# Altium project Blue_Pill.PrjPcb
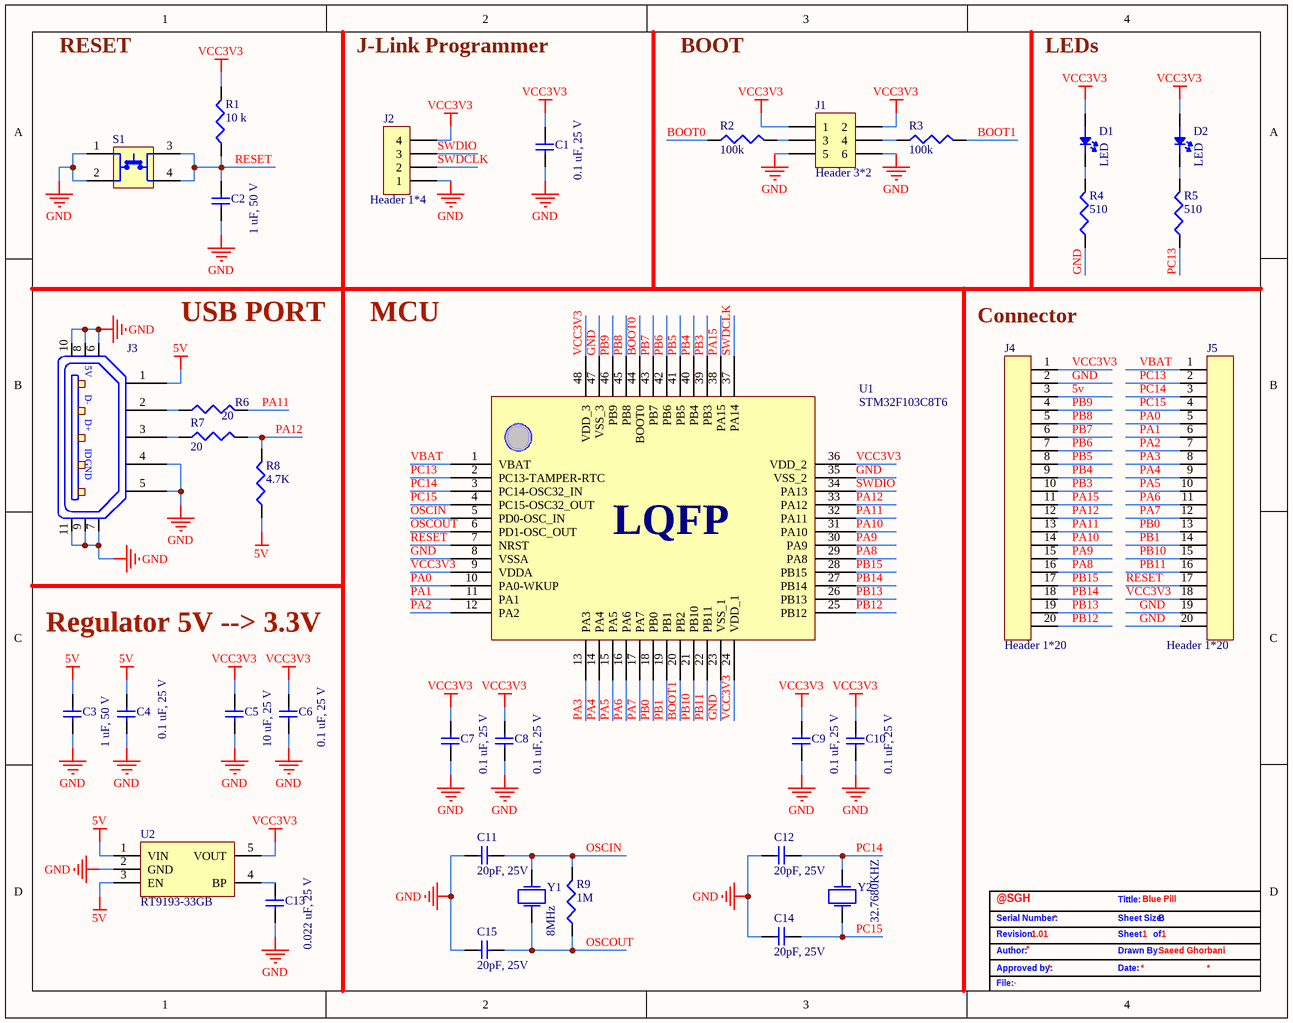
[diagram p0: Blue_Pill_Sehmatic.SchDoc]
1 sheet, 36 parts. Net scope: global (net labels, ports and power ports of the same name join across sheets).
Board file: Blue_Pill_pcb.PcbDoc

## Sheet Blue_Pill_Sehmatic.SchDoc: Blue Pill
size A; DrawnBy: Saeed Ghorbani; Revision: 1.01; SheetNumber: 1; SheetTotal: 1

### Parts
C1  0.1 uF, 25 V  [C0805]
C2  1 uF, 50 V  [C0805]
C3  1 uF, 50 V  [C0805]
C4  0.1 uF, 25 V  [C0805]
C5  10 uF, 25 V  [C0805]
C6  0.1 uF, 25 V  [C0805]
C7  0.1 uF, 25 V  [C0805]
C8  0.1 uF, 25 V  [C0805]
C9  0.1 uF, 25 V  [C0805]
C10  0.1 uF, 25 V  [C0805]
C11  20pF, 25V  [C0805]
C12  20pF, 25V  [C0805]
C13  0.022 uF, 25 V  [C0805]
C14  20pF, 25V  [C0805]
C15  20pF, 25V  [C0805]
D1  LED  [LED0603]
D2  LED  [LED0603]
J1  Header 3*2  [Header 3*2]
J2  Header 1*4  [Header 4*1]
J3  10118194-0001LF  [10118194-0001LF]  (value not drawn)
J4  Header 1*20  [header 20*1]
J5  Header 1*20  [header 20*1]
R1  10 k  [R0805]
R2  100k  [R0805]
R3  100k  [R0805]
R4  510  [R0805]
R5  510  [R0805]
R6  20  [R0805]
R7  20  [R0805]
R8  4.7K  [R0805]
R9  1M  [R0805]
S1  PTS526SM15SMTR2LFS  [PTS526SM15SMTR2LFS]  (value not drawn)
U1  STM32F103C8T6  [LQFP48]
U2  RT9193-33GB  [SOT95P280X100-5N]
Y1  8MHz  [FC4SD]
Y2  32.7680KHZ  [CM8V-T1A]

### Nets
5v: C3.2 C4.2 J3.1 J4.3 R8.1 U2.1(VIN) U2.3(EN)
GND: C1.1 C2.1 C3.1 C4.1 C5.1 C6.1 C7.1 C8.1 C9.1 C10.1 C11.1 C12.1 C13.1 C14.1 C15.1 J1.5 J1.6 J2.1 J3.4 J3.5 J3.6 J3.7 J3.8 J3.9 J3.10 J3.11 J4.2 J5.19 J5.20 R4.1 S1.1 S1.2 U1.8(VSSA) U1.23(VSS_1) U1.35(VSS_2) U1.47(VSS_3) U2.2(GND)
VCC3V3: C1.2 C5.2 C6.2 C7.2 C8.2 C9.2 C10.2 D1.1(Anode) D2.1(Anode) J1.1 J1.2 J2.4 J4.1 J5.18 R1.2 U1.9(VDDA) U1.24(VDD_1) U1.36(VDD_2) U1.48(VDD_3) U2.5(VOUT)
BOOT0: R2.1 U1.44(BOOT0)
BOOT1: R3.2 U1.20(PB2)
OSCIN: C11.2 R9.2 U1.5(PD0-OSC_IN) Y1.2
OSCOUT: C15.2 R9.1 U1.6(PD1-OSC_OUT) Y1.1
PA0: J5.5 U1.10(PA0-WKUP)
PA1: J5.6 U1.11(PA1)
PA2: J5.7 U1.12(PA2)
PA3: J5.8 U1.13(PA3)
PA4: J5.9 U1.14(PA4)
PA5: J5.10 U1.15(PA5)
PA6: J5.11 U1.16(PA6)
PA7: J5.12 U1.17(PA7)
PA8: J4.16 U1.29(PA8)
PA9: J4.15 U1.30(PA9)
PA10: J4.14 U1.31(PA10)
PA11: J4.13 R6.2 U1.32(PA11)
PA12: J4.12 R7.2 R8.2 U1.33(PA12)
PA15: J4.11 U1.38(PA15)
PB0: J5.13 U1.18(PB0)
PB1: J5.14 U1.19(PB1)
PB3: J4.10 U1.39(PB3)
PB4: J4.9 U1.40(PB4)
PB5: J4.8 U1.41(PB5)
PB6: J4.7 U1.42(PB6)
PB7: J4.6 U1.43(PB7)
PB8: J4.5 U1.45(PB8)
PB9: J4.4 U1.46(PB9)
PB10: J5.15 U1.21(PB10)
PB11: J5.16 U1.22(PB11)
PB12: J4.20 U1.25(PB12)
PB13: J4.19 U1.26(PB13)
PB14: J4.18 U1.27(PB14)
PB15: J4.17 U1.28(PB15)
PC13: J5.2 R5.1 U1.2(PC13-TAMPER-RTC)
PC14: C12.2 J5.3 U1.3(PC14-OSC32_IN) Y2.2
PC15: C14.2 J5.4 U1.4(PC15-OSC32_OUT) Y2.1
RESET: C2.2 J5.17 R1.1 S1.3 S1.4 U1.7(NRST)
SWDCLK: J2.2 U1.37(PA14)
SWDIO: J2.3 U1.34(PA13)
VBAT: J5.1 U1.1(VBAT)
NetC13_2: C13.2 U2.4(BP)
NetD1_2: D1.2(Cathode) R4.2
NetD2_2: D2.2(Cathode) R5.2
NetJ1_3: J1.3 R2.2
NetJ1_4: J1.4 R3.1
NetJ3_2: J3.2 R6.1
NetJ3_3: J3.3 R7.1

### Notes on the sheet
- RESET
- J-Link Programmer
- BOOT
- LEDs
- USB PORT
- MCU
- (near J4) Connector
- Regulator 5V --> 3.3V
- @SGH
- Tittle:
- Serial Number:
- Revision:
- Author:
- Approved by:
- Sheet Size:
- Sheet     of
- Drawn By:
- Date:
- B
- File:
- (in symbol 10118194-0001LF) 5V; D-; D+; ID; GND

### Library data of the parts
C1 C4 C6-C10 = C0805C104K3RACTU: Multilayer Ceramic Capacitor, 0.1 uF, 25 V, ± 10%, X7R, 0805 [2012 Metric]; Manufacturer: KEMET; Material: 4241ConductorMaterial; Value: 100nF; Voltage Rating: 25V; Temperature Coefficient: 30ppm/°C; Supplier: Mouser; Supplier Part Number: 80-C0805C104K3R; Manufacturer Part Number: C0805C104K3RACTU; RoHS: Yes; Category: Ceramic Capacitors; Stock: 364608; Pricing: 1=0.11, 10=0.048, 50=0.048, 100=0.028, 1000=0.024, 10000=0.016 (USD); Mounting Technology: Surface Mount,PCB; Case/Package: 0805; Pins: 2NUMBER; Case Code (Imperial): 0805; Case Code (Metric): 2012; Min Operating Temperature: -55°C; Max Operating Temperature: 125°C; Tolerance: 10%; Dielectric: X7R; Packaging: Tape and Reel; Termination: SMD/SMT; Package Quantity: 4000; Series: SMD Comm X7R; Voltage Rating (DC): 25V; Construction: Flat; Length: 2mm; Width: 1.2mm; Height: 0.9mm; Depth: 1.25mm; Lead Pitch: 0.75mm; Thickness: 889um; Radiation Hardening: No; RoHS Compliant: Yes; Lead Free: 5697LeadFree; Reach SVHC Compliant: 4186SVHC; ComponentLink1URL: https://datasheet.ciiva.com/7842/kem-c1002-x7r-smd-7842538.pdf?src-supplier=Element14; ComponentLink1Description: https://datasheet.ciiva.com/7842/kem-c1002-x7r-smd-7842538.pdf?src-supplier=Element14; ComponentLink2URL: https://datasheet.ciiva.com/7842/kem-c1002-x7r-smd-7842536.pdf?src-supplier=Element14; ComponentLink2Description: https://datasheet.ciiva.com/7842/kem-c1002-x7r-smd-7842536.pdf?src-supplier=Element14; ComponentLink3URL: https://datasheet.ciiva.com/18193/getdatasheetpartid-385649-18193413.pdf?src-supplier=Verical; ComponentLink3Description: https://datasheet.ciiva.com/18193/getdatasheetpartid-385649-18193413.pdf?src-supplier=Verical
C2 C3 = C0805C105K5RACTU: Multilayer Ceramic Capacitor, 1 uF, 50 V, ± 10%, X7R, 0805 [2012 Metric]; Manufacturer: KEMET; Material: 4241ConductorMaterial; Value: 1uF; Voltage Rating: 50V; Supplier: Mouser; Supplier Part Number: 80-C0805C105K5R; Manufacturer Part Number: C0805C105K5RACTU; RoHS: Yes; Category: Ceramic Capacitors; Stock: 466053; Pricing: 1=0.34, 10=0.17, 50=0.17, 100=0.11, 1000=0.087, 10000=0.077 (USD); Mounting Technology: Surface Mount,PCB; Case/Package: 0805; Case Code (Metric): 2012; Case Code (Imperial): 0805; Dielectric Material: Ceramic; Min Operating Temperature: -55°C; Max Operating Temperature: 125°C; Packaging: Tape and Reel; Tolerance: 10%; Voltage Rating (DC): 50V; Package Quantity: 1; Dielectric: X7R; Termination: SMD/SMT; Voltage: 50V; Series: C; Construction: Flat; Length: 2mm; Width: 0.049inch; Height: 1.25mm; Thickness: 0.055inch; Depth: 1.25mm; Reach SVHC Compliant: No; RoHS Compliant: Yes; ComponentLink1URL: https://datasheet.ciiva.com/7842/1732744-7842192.pdf?src-supplier=Element14; ComponentLink1Description: https://datasheet.ciiva.com/7842/1732744-7842192.pdf?src-supplier=Element14; ComponentLink2URL: https://datasheet.ciiva.com/22700/1851736-22700523.pdf?src-supplier=Element14; ComponentLink2Description: https://datasheet.ciiva.com/22700/1851736-22700523.pdf?src-supplier=Element14
C5 = CC0805KKX5R8BB106: Multilayer Ceramic Capacitor, 10 uF, 25 V, ± 10%, X5R, 0805 [2012 Metric]; Manufacturer: Yageo; Material: 4241ConductorMaterial; Value: 10uF; Voltage Rating (DC): 25V; Supplier: Rs; Supplier Part Number: 1988078; Manufacturer Part Number: CC0805KKX5R8BB106; RoHS: Yes; Category: Ceramic Capacitors; Stock: 60; Pricing: 20=0.169, 100=0.135, 500=0.11, 800=0.154, 1000=0.093 (GBP); Mounting Technology: Surface Mount; Case/Package: 0805; Case Code (Imperial): 0805; Case Code (Metric): 2012; Weight: 0.000194oz; Min Operating Temperature: -55°C; Max Operating Temperature: 85°C; Tolerance: 10%; Packaging: Tape and Reel; Voltage Rating: 25V; Dielectric: X5R; Termination: SMD/SMT; Series: CC; Length: 0.079inch; Width: 0.049inch; Height: 1.45mm; Thickness: 0.057inch; RoHS Compliant: Yes; Halogen Free: 5694HalogenFree; Lead Free: 5697LeadFree; ComponentLink1URL: http://www.mouser.com/ds/2/447/UPY-GPHC_X5R_4V-to-50V_25-1131599.pdf?src-supplier=Mouser; ComponentLink1Description: http://www.mouser.com/ds/2/447/UPY-GPHC_X5R_4V-to-50V_25-1131599.pdf?src-supplier=Mouser; ComponentLink2URL: https://datasheet.octopart.com/CC0805KKX5R8BB106-Yageo-datasheet-140260304.pdf?src-supplier=Newark; ComponentLink2Description: https://datasheet.octopart.com/CC0805KKX5R8BB106-Yageo-datasheet-140260304.pdf?src-supplier=Newark; ComponentLink3URL: https://datasheet.octopart.com/CC0805KKX5R8BB106-Yageo-datasheet-170350636.pdf?src-supplier=Future+Electronics; ComponentLink3Description: https://datasheet.octopart.com/CC0805KKX5R8BB106-Yageo-datasheet-170350636.pdf?src-supplier=Future+Electronics; ComponentLink4URL: http://www.yageo.com/documents/recent/UPY-GPHC_X5R_4V-to-50V_25.pdf?src-supplier=Digikey; ComponentLink4Description: http://www.yageo.com/documents/recent/UPY-GPHC_X5R_4V-to-50V_25.pdf?src-supplier=Digikey
C11 C12 C14 C15 = C0805C200J3HACAUTO: Cap Cer 0805 20PF 25V Ultra Stab; Manufacturer: KEMET; Supplier: Mouser; Supplier Part Number: 80-C0805C200J3HAUTO; Manufacturer Part Number: C0805C200J3HACAUTO; RoHS: Yes; Category: Ceramic Capacitors; Stock: 11117; Pricing: 1=0.15, 10=0.061, 50=0.061, 100=0.036, 1000=0.028, 10000=0.02 (USD); RoHS Compliant: Yes
C13 = C0805C223J3GACTU: Multilayer Ceramic Capacitor, 0.022 uF, 25 V, ± 5%, C0G (NP0), 0805 [2012 Metric]; Manufacturer: KEMET; Material: 4241ConductorMaterial; Value: 22nF; Voltage Rating: 25V; Dissipation Factor: 0.1%; Temperature Coefficient: 30ppm/°C; Supplier: Mouser; Supplier Part Number: 80-C0805C223J3G; Manufacturer Part Number: C0805C223J3GACTU; RoHS: Yes; Category: Ceramic Capacitors; Stock: 19291; Pricing: 1=0.41, 10=0.27, 50=0.27, 100=0.163, 1000=0.109, 10000=0.088 (USD); Mounting Technology: Surface Mount; Case/Package: 0805; Case Code (Imperial): 0805; Case Code (Metric): 2012; Dielectric Material: 4241ConductorMaterial; Min Operating Temperature: -55°C; Max Operating Temperature: 125°C; Tolerance: 5%; Dielectric: C0G; Packaging: Tape and Reel; Voltage Rating (DC): 25V; Package Quantity: 4000; Termination: SMD/SMT; Voltage: 25V; Series: SMD Comm C0G; Construction: Flat; Length: 2mm; Width: 1.2mm; Height: 0.9mm; Depth: 1.25mm; Thickness: 0.039inch; Radiation Hardening: No; Reach SVHC Compliant: No; RoHS Compliant: Yes; Lead Free: 5697LeadFree; ComponentLink1URL: http://components.arrow.com/part/dataview/46124259S8614547N7429?src-supplier=Arrow+Electronics; ComponentLink1Description: http://components.arrow.com/part/dataview/46124259S8614547N7429?src-supplier=Arrow+Electronics; ComponentLink2URL: http://www.farnell.com/datasheets/2741014.pdf?src-supplier=Farnell; ComponentLink2Description: http://www.farnell.com/datasheets/2741014.pdf?src-supplier=Farnell; ComponentLink3URL: http://www.mouser.com/ds/2/212/KEM_C1003_C0G_SMD-1101588.pdf?src-supplier=Mouser; ComponentLink3Description: http://www.mouser.com/ds/2/212/KEM_C1003_C0G_SMD-1101588.pdf?src-supplier=Mouser; ComponentLink4URL: https://datasheet.octopart.com/C0805C223J3GACTU-Kemet-datasheet-14356739.pdf?src-supplier=Newark; ComponentLink4Description: https://datasheet.octopart.com/C0805C223J3GACTU-Kemet-datasheet-14356739.pdf?src-supplier=Newark; ComponentLink5URL: https://api.kemet.com/component-edge/download/datasheet/C0805C223J3GACTU.pdf?src-supplier=Digi-Key; ComponentLink5Description: https://api.kemet.com/component-edge/download/datasheet/C0805C223J3GACTU.pdf?src-supplier=Digi-Key; ComponentLink6URL: http://www.kemet.com/docfinder?Partnumber=C0805C223J3GACTU&src-supplier=Digikey; ComponentLink6Description: http://www.kemet.com/docfinder?Partnumber=C0805C223J3GACTU&src-supplier=Digikey; ComponentLink7URL: https://www.verical.com/server-webapp/html/getDatasheet?partID=512137&src-supplier=Verical; ComponentLink7Description: https://www.verical.com/server-webapp/html/getDatasheet?partID=512137&src-supplier=Verical; ComponentLink8URL: http://www.farnell.com/datasheets/2741014.pdf?src-supplier=Newark; ComponentLink8Description: http://www.farnell.com/datasheets/2741014.pdf?src-supplier=Newark; ComponentLink9URL: https://datasheet.octopart.com/C0805C223J3GACTU-Kemet-datasheet-66532318.pdf?src-supplier=Element14; ComponentLink9Description: https://datasheet.octopart.com/C0805C223J3GACTU-Kemet-datasheet-66532318.pdf?src-supplier=Element14; ComponentLink10URL: https://datasheet.octopart.com/C0805C223J3GACTU-KEMET-datasheet-101576230.pdf?src-supplier=Farnell; ComponentLink10Description: https://datasheet.octopart.com/C0805C223J3GACTU-KEMET-datasheet-101576230.pdf?src-supplier=Farnell; ComponentLink11URL: http://www.farnell.com/datasheets/2741014.pdf?src-supplier=Element14; ComponentLink11Description: http://www.farnell.com/datasheets/2741014.pdf?src-supplier=Element14; ComponentLink12URL: http://capacitoredge.kemet.com/capedge2/DataSheet?pn=C0805C223J3GACTU&src-supplier=Avnet; ComponentLink12Description: http://capacitoredge.kemet.com/capedge2/DataSheet?pn=C0805C223J3GACTU&src-supplier=Avnet; ComponentLink13URL: https://datasheet.octopart.com/C0805C223J3GACTU-KEMET-datasheet-37178240.pdf?src-supplier=Electro+Sonic; ComponentLink13Description: https://datasheet.octopart.com/C0805C223J3GACTU-KEMET-datasheet-37178240.pdf?src-supplier=Electro+Sonic
D1 D2 = LTST-C191KFKT: Orange 0603 130° Water Clear 90 mcd 2 V SMT Rectangular Flat Top LED; Manufacturer: Vishay Lite-On; Lens Color: Colorless; Lens Style: Flat,Diffused,Colorless,Rectangular; Luminous Intensity: 90mcd; Forward Current: 30mA; Forward Voltage: 2V; Test Current: 20mA; Number of LEDs: 1; Power Rating: 75mW; Dominant Wavelength: 605nm; Wavelength: 611nm; Reverse Voltage: 5V; Lens Size: 0.8mm; Supplier: Arrow Electronics; Supplier Part Number: LTST-C191KFKT; Manufacturer Part Number: LTST-C191KFKT; RoHS: Yes; Category: LEDs; Stock: 40000; Pricing: 40000=0.028, 125000=0.0261 (USD); Mounting Technology: Surface Mount; Case/Package: 0603; Pins: 2; Color: Orange; Case Code (Metric): 1608; Case Code (Imperial): 0603; Min Operating Temperature: -55°C; Max Operating Temperature: 85°C; Package Quantity: 5000; Viewing Angle: 130°; Packaging: Tape and Reel; Illumination Color: Orange; Lens Transparency: Clear; Series: -; Number of Elements: 1; Power Dissipation: 75mW; Length: 1.6mm; Width: 0.8mm; Height: 0.65mm; Depth: 0.8mm; Radiation Hardening: No; RoHS Compliant: Yes; Lead Free: 5697LeadFree; ComponentLink1URL: https://datasheet.ciiva.com/2109/ltst-c191kfkt-2109968.pdf?src-supplier=Digikey; ComponentLink1Description: https://datasheet.ciiva.com/2109/ltst-c191kfkt-2109968.pdf?src-supplier=Digikey; ComponentLink2URL: https://datasheet.ciiva.com/11775/0900766b80dc02b0-11775613.pdf?src-supplier=Rs; ComponentLink2Description: https://datasheet.ciiva.com/11775/0900766b80dc02b0-11775613.pdf?src-supplier=Rs; ComponentLink3URL: https://datasheet.ciiva.com/12400/100-ltst-c191kfkt-39904-12400811.pdf?src-supplier=Mouser; ComponentLink3Description: https://datasheet.ciiva.com/12400/100-ltst-c191kfkt-39904-12400811.pdf?src-supplier=Mouser; ComponentLink4URL: https://datasheet.ciiva.com/15201/getdatasheetpartid-631075-15201391.pdf?src-supplier=Verical; ComponentLink4Description: https://datasheet.ciiva.com/15201/getdatasheetpartid-631075-15201391.pdf?src-supplier=Verical; ComponentLink5URL: https://datasheet.ciiva.com/2109/s-110-ltst-c191kfkt-2109969.pdf?src-supplier=Digikey; ComponentLink5Description: https://datasheet.ciiva.com/2109/s-110-ltst-c191kfkt-2109969.pdf?src-supplier=Digikey
J1 = M20-9980345: Conn Unshrouded Header HDR 6 POS 2.54mm Solder ST Top Entry Thru-Hole Bulk/Loose; Manufacturer: Harwin; Supplier: Rs; Supplier Part Number: 6812947P; Manufacturer Part Number: M20-9980345; RoHS: Yes; Category: Headers and Wire Housings; Stock: 1710; Pricing: 250=0.146, 1000=0.124, 5000=0.1, 10000=0.092 (GBP); ComponentLink1URL: https://datasheet.ciiva.com/6789/91635-6789923.pdf?src-supplier=Newark; ComponentLink1Description: https://datasheet.ciiva.com/6789/91635-6789923.pdf?src-supplier=Newark; ComponentLink2URL: https://datasheet.ciiva.com/11746/0900766b80da602b-11746662.pdf?src-supplier=Rs; ComponentLink2Description: https://datasheet.ciiva.com/11746/0900766b80da602b-11746662.pdf?src-supplier=Rs; ComponentLink3URL: https://datasheet.ciiva.com/26852/getdatasheetpartid-420465-26852189.pdf?src-supplier=Verical; ComponentLink3Description: https://datasheet.ciiva.com/26852/getdatasheetpartid-420465-26852189.pdf?src-supplier=Verical; ComponentLink4URL: https://datasheet.ciiva.com/8046/112195-8046904.pdf?src-supplier=Element14; ComponentLink4Description: https://datasheet.ciiva.com/8046/112195-8046904.pdf?src-supplier=Element14; ComponentLink5URL: https://datasheet.ciiva.com/6830/m20-998-6830775.pdf?src-supplier=Digikey; ComponentLink5Description: https://datasheet.ciiva.com/6830/m20-998-6830775.pdf?src-supplier=Digikey
J2 = M20-9960445: Conn Unshrouded Header HDR 4 POS 2.54mm Solder RA Thru-Hole Bag; Manufacturer: Harwin; Current Rating: 3A; Voltage Rating: 750V; Number of Positions: 4; Gender: Male; Supplier: Digikey; Supplier Part Number: 952-3286-ND; Manufacturer Part Number: M20-9960445; RoHS: Yes; Category: Headers and Wire Housings; Stock: 9573; Pricing: 1=0.31, 10=0.267, 100=0.2079, 1000=0.14847, 5000=0.12726, 10000=0.11878 (USD); Mounting Technology: Through Hole; Case/Package: SIL; Contact Plating: Gold; Contact Material: Brass; Color: Black; Housing Material: Nylon; Contact Shape: Square; Contact Finish - Mating: GOLD; Insulation Material: Nylon; Insulation Color: Black; Min Operating Temperature: -40°C; Max Operating Temperature: 105°C; Package Quantity: 1000; Packaging: Bulk; Series: M20; Number of Rows: 1; Termination: Solder; Number of Contacts: 4; Contact Type: Male Pin; Fastening Type: Pull; Pitch: 2.54mm; Contact Mating Length: 0.24inch; RoHS Compliant: Yes; Flammability Rating: UL94 V-0; ComponentLink1URL: https://datasheet.ciiva.com/9480/m20-996-9480181.pdf?src-supplier=Avnet; ComponentLink1Description: https://datasheet.ciiva.com/9480/m20-996-9480181.pdf?src-supplier=Avnet; ComponentLink2URL: https://datasheet.ciiva.com/12921/m20-996-12921995.pdf?src-supplier=Mouser; ComponentLink2Description: https://datasheet.ciiva.com/12921/m20-996-12921995.pdf?src-supplier=Mouser
J3 = 10118194-0001LF: CONN USB MICRO B RECPT SMT R/A; Manufacturer: Amphenol ICC / FCI; Connector Type: USB,Receptacle; Number of Contacts: 5; Gender: Receptacle; Current Rating: 1.8A; Insulation Resistance: 1GR; Number of Ports: 1; Max Voltage Rating (AC): 100V; Supplier: Arrow Electronics; Supplier Part Number: 10118194-0001LF; Manufacturer Part Number: 10118194-0001LF; RoHS: No; Category: USB Connectors; Stock: 19200; Pricing: 9600=0.1965 (USD); Mounting Technology: Surface Mount,Horizontal; Pins: 5; Contact Material: Copper Alloy; Contact Plating: Gold; Housing Material: Polymer; Color: Black; Min Operating Temperature: -55°C; Max Operating Temperature: 85°C; Features: Shielded; Packaging: Tape and Reel; Termination: Solder; Orientation: Right Angle; Series: -; Package Quantity: 9600; Length: 8.05mm; Depth: 5mm; Flammability Rating: UL94 V-0
J4 J5 = M20-9992045: 2.54mm (0.1") Pitch SIL Vertical PC Tail Pin Header, 6.1mm mating pin height, gold (hi-temp mould), 20 contacts; Manufacturer: Harwin; Number of Positions: 20; Gender: Male; Supplier: Farnell; Supplier Part Number: 3226019; Manufacturer Part Number: M20-9992045; RoHS: Yes; Category: Headers and Wire Housings; Stock: 1665; Pricing: 10=0.766, 50=0.699, 100=0.632, 250=0.575, 500=0.517, 1500=0.46 (EUR); Mounting Technology: Through Hole; Case/Package: SIL; Contact Plating: Gold; Color: Black; Number of Rows: 1; Package Quantity: 200; Packaging: Bulk; Termination: Solder; Number of Contacts: 20; Series: M20; Contact Type: Male Pin; Pitch: 2.54mm; Contact Mating Length: 0.24inch; Radiation Hardening: No; RoHS Compliant: Yes; ComponentLink1URL: https://datasheet.ciiva.com/5159/m20-999-351179-5159781.pdf?src-supplier=Mouser; ComponentLink1Description: https://datasheet.ciiva.com/5159/m20-999-351179-5159781.pdf?src-supplier=Mouser
R1 = RC0805JR-0710KL: SMD Chip Resistor, 10 kOhm, ± 5%, 125 mW, 0805 [2012 Metric], Thick Film, General Purpose; Manufacturer: Yageo; Value: 10kR; Power Rating: 125mW; Temperature Coefficient: 100ppm/°C; Voltage Rating: 150V; Supplier: Future Electronics; Supplier Part Number: 9330259; Manufacturer Part Number: RC0805JR-0710KL; RoHS: Yes; Category: Chip SMD Resistors; Stock: 9465000; Pricing: 5000=0.0023, 25000=0.0021, 100000=0.002, 250000=0.002, 625000=0.0018 (USD); Case/Package: 0805; Contact Plating: Tin,Matte; Case Code (Imperial): 0805; Case Code (Metric): 2012; Min Operating Temperature: -55°C; Max Operating Temperature: 155°C; Resistor Type: Thick Film; Tolerance: 5%; Packaging: Tape and Reel; Termination: SMD/SMT; Features: Moisture Resistant; Series: RC; Max Power Dissipation: 125mW; Number of Terminations: 2; Resistance Tolerance: 5%; Construction: Rectangular; Length: 2mm; Width: 1.25mm; Height: 0.5mm; Depth: 1.25mm; Radiation Hardening: No; RoHS Compliant: Yes; Military Standard: Not; Reach SVHC Compliant: Unknown; Lead Free: 5697LeadFree; ComponentLink1URL: https://datasheet.ciiva.com/7983/444164-7983765.pdf?src-supplier=Element14; ComponentLink1Description: https://datasheet.ciiva.com/7983/444164-7983765.pdf?src-supplier=Element14; ComponentLink2URL: https://datasheet.ciiva.com/7941/444164-7941870.pdf?src-supplier=Element14; ComponentLink2Description: https://datasheet.ciiva.com/7941/444164-7941870.pdf?src-supplier=Element14; ComponentLink3URL: https://datasheet.ciiva.com/7941/444164-7941871.pdf?src-supplier=Element14; ComponentLink3Description: https://datasheet.ciiva.com/7941/444164-7941871.pdf?src-supplier=Element14
R2 R3 = RC0805FR-07100KL: SMD Chip Resistor, 100 kOhm, ± 1%, 125 mW, 0805 [2012 Metric], Thick Film, General Purpose; Manufacturer: Yageo; Value: 100kR; Power Rating: 125mW; Voltage Rating (DC): 150V; Temperature Coefficient: 100ppm/°C; Supplier: Future Electronics; Supplier Part Number: 2952521; Manufacturer Part Number: RC0805FR-07100KL; RoHS: Yes; Category: Chip SMD Resistors; Stock: 2010000; Pricing: 5000=0.0027, 25000=0.0025, 100000=0.0024, 250000=0.0023, 625000=0.0021 (USD); Case/Package: 0805; Pins: 2; Case Code (Metric): 2012; Case Code (Imperial): 0805; Min Operating Temperature: -55°C; Max Operating Temperature: 155°C; Resistor Type: Thick Film; Tolerance: 1%; Packaging: Tape and Reel; Voltage Rating: 150V; Package Quantity: 1; Number of Terminations: 2; Termination: SMD/SMT; Max Power Dissipation: 125mW; Features: Moisture Resistant; Series: RC; Construction: Rectangular; Resistance Tolerance: 1%; Technology: THICK FILM; Voltage Rating (AC): 150V; Length: 0.079inch; Width: 0.049inch; Height: 0.024inch; Depth: 1.25mm; Lead Pitch: 0.4mm; RoHS Compliant: Yes; Reach SVHC Compliant: Unknown; Lead Free: 5697LeadFree; Military Standard: Not; ComponentLink1URL: https://datasheet.ciiva.com/11808/0900766b8106beab-11808858.pdf?src-supplier=Rs; ComponentLink1Description: https://datasheet.ciiva.com/11808/0900766b8106beab-11808858.pdf?src-supplier=Rs; ComponentLink2URL: https://datasheet.ciiva.com/7941/1686128-7941677.pdf?src-supplier=Element14; ComponentLink2Description: https://datasheet.ciiva.com/7941/1686128-7941677.pdf?src-supplier=Element14; ComponentLink3URL: https://datasheet.ciiva.com/7660/38627-7660796.pdf?src-supplier=Element14; ComponentLink3Description: https://datasheet.ciiva.com/7660/38627-7660796.pdf?src-supplier=Element14; ComponentLink4URL: https://datasheet.ciiva.com/22747/444164-22747534.pdf?src-supplier=Element14; ComponentLink4Description: https://datasheet.ciiva.com/22747/444164-22747534.pdf?src-supplier=Element14; ComponentLink5URL: https://datasheet.ciiva.com/2457/pyu-r-int-thick-7-2457018.pdf?src-supplier=Digikey; ComponentLink5Description: https://datasheet.ciiva.com/2457/pyu-r-int-thick-7-2457018.pdf?src-supplier=Digikey; ComponentLink6URL: https://datasheet.ciiva.com/2457/pyu-r-int-thick-7-2457019.pdf?src-supplier=Digikey; ComponentLink6Description: https://datasheet.ciiva.com/2457/pyu-r-int-thick-7-2457019.pdf?src-supplier=Digikey; ComponentLink7URL: https://datasheet.ciiva.com/2457/pyu-r-int-thick-7-2457017.pdf?src-supplier=Digikey; ComponentLink7Description: https://datasheet.ciiva.com/2457/pyu-r-int-thick-7-2457017.pdf?src-supplier=Digikey; ComponentLink8URL: https://datasheet.ciiva.com/12667/rc0805-12667001.pdf?src-supplier=Mouser; ComponentLink8Description: https://datasheet.ciiva.com/12667/rc0805-12667001.pdf?src-supplier=Mouser; ComponentLink9URL: https://datasheet.ciiva.com/7941/1697719-7941676.pdf?src-supplier=Element14; ComponentLink9Description: https://datasheet.ciiva.com/7941/1697719-7941676.pdf?src-supplier=Element14; ComponentLink10URL: https://datasheet.ciiva.com/7941/1697719-7941678.pdf?src-supplier=Element14; ComponentLink10Description: https://datasheet.ciiva.com/7941/1697719-7941678.pdf?src-supplier=Element14; ComponentLink11URL: https://datasheet.ciiva.com/16747/rc0805-16747226.pdf?src-supplier=Future+Electronics; ComponentLink11Description: https://datasheet.ciiva.com/16747/rc0805-16747226.pdf?src-supplier=Future+Electronics
R4 R5 = RC0805JR-07510RL: Res Thick Film 0805 510 Ohm 5% 1/8W ±100ppm/°C SMD Paper T/R; Manufacturer: Yageo; Value: 510R; Power Rating: 125mW; Voltage Rating: 150V; Voltage Rating (DC): 300V; Supplier: Future Electronics; Supplier Part Number: 3650397; Manufacturer Part Number: RC0805JR-07510RL; RoHS: Yes; Category: Chip SMD Resistors; Stock: 200000; Pricing: 5000=0.0023, 25000=0.0021, 50000=0.0022, 100000=0.002, 200000=0.0021, 250000=0.002, 625000=0.002, 2000000=0.0018 (USD); Case/Package: 0805; Contact Plating: Tin,Lead; Case Code (Metric): 2012; Case Code (Imperial): 0805; Min Operating Temperature: -55°C; Max Operating Temperature: 155°C; Tolerance: 5%; Temperature Coefficient: 100ppm/°C; Packaging: Tape and Reel; Number of Terminations: 2; Termination: SMD/SMT; Max Power Dissipation: 125mW; Working Voltage: 150V; Features: Moisture Resistant; Series: RC; Technology: THICK FILM; Construction: Rectangular; Length: 2mm; Depth: 1.25mm; Military Standard: Not; Lead Free: Lead Free; RoHS Compliant: Yes; ComponentLink1URL: https://datasheet.ciiva.com/2519/pyu-r-int-thick-7-2519247.pdf?src-supplier=Digikey; ComponentLink1Description: https://datasheet.ciiva.com/2519/pyu-r-int-thick-7-2519247.pdf?src-supplier=Digikey; ComponentLink2URL: https://datasheet.ciiva.com/2519/pyu-r-int-thick-7-2519248.pdf?src-supplier=Digikey; ComponentLink2Description: https://datasheet.ciiva.com/2519/pyu-r-int-thick-7-2519248.pdf?src-supplier=Digikey; ComponentLink3URL: https://datasheet.ciiva.com/2519/pyu-r-int-thick-7-2519246.pdf?src-supplier=Digikey; ComponentLink3Description: https://datasheet.ciiva.com/2519/pyu-r-int-thick-7-2519246.pdf?src-supplier=Digikey; ComponentLink4URL: https://datasheet.ciiva.com/12656/rc0805-12656876.pdf?src-supplier=Mouser; ComponentLink4Description: https://datasheet.ciiva.com/12656/rc0805-12656876.pdf?src-supplier=Mouser; ComponentLink5URL: https://datasheet.ciiva.com/16741/rc0805-16741256.pdf?src-supplier=Future+Electronics; ComponentLink5Description: https://datasheet.ciiva.com/16741/rc0805-16741256.pdf?src-supplier=Future+Electronics
R6 R7 = RC0805JR-0720RL: SMD Chip Resistor, 20 Ohm, ± 5%, 125 mW, 0805 [2012 Metric], Thick Film, General Purpose; Manufacturer: Yageo; Supplier: Future Electronics; Supplier Part Number: 9756750; Manufacturer Part Number: RC0805JR-0720RL; RoHS: Yes; Category: Chip SMD Resistors; Stock: 370000; Pricing: 5000=0.0035, 25000=0.0033, 50000=0.0033, 100000=0.0031, 150000=0.0032, 250000=0.003, 625000=0.003, 1500000=0.0028 (USD); ComponentLink1URL: https://datasheet.ciiva.com/17053/rc0805-17053597.pdf?src-supplier=Future+Electronics; ComponentLink1Description: https://datasheet.ciiva.com/17053/rc0805-17053597.pdf?src-supplier=Future+Electronics; ComponentLink2URL: https://datasheet.ciiva.com/2456/pyu-r-int-thick-7-2456300.pdf?src-supplier=Digikey; ComponentLink2Description: https://datasheet.ciiva.com/2456/pyu-r-int-thick-7-2456300.pdf?src-supplier=Digikey; ComponentLink3URL: https://datasheet.ciiva.com/2456/pyu-r-int-thick-7-2456301.pdf?src-supplier=Digikey; ComponentLink3Description: https://datasheet.ciiva.com/2456/pyu-r-int-thick-7-2456301.pdf?src-supplier=Digikey; ComponentLink4URL: https://datasheet.ciiva.com/2456/pyu-r-int-thick-7-2456302.pdf?src-supplier=Digikey; ComponentLink4Description: https://datasheet.ciiva.com/2456/pyu-r-int-thick-7-2456302.pdf?src-supplier=Digikey
R8 = RC0805FR-134K7L: Res Thick Film 0805 4.7K Ohm 1% 1/8W ±100ppm/°C SMD Paper T/R; Manufacturer: Yageo; Supplier: Future Electronics; Supplier Part Number: 7067790; Manufacturer Part Number: RC0805FR-134K7L; RoHS: Yes; Category: Chip SMD Resistors; Stock: 800000; Pricing: 20000=0.0027, 60000=0.0026, 200000=0.0025, 400000=0.0024, 800000=0.0023 (USD); ComponentLink1URL: http://www.mouser.com/ds/2/447/Yageo_08112016_RC0805-968729.pdf?src-supplier=Mouser; ComponentLink1Description: http://www.mouser.com/ds/2/447/Yageo_08112016_RC0805-968729.pdf?src-supplier=Mouser; ComponentLink2URL: http://www.yageo.com/pdf/PYu-RC0805_51_RoHS_L_4.pdf?src-supplier=Avnet; ComponentLink2Description: http://www.yageo.com/pdf/PYu-RC0805_51_RoHS_L_4.pdf?src-supplier=Avnet; ComponentLink3URL: https://datasheet.octopart.com/RC0805FR-134K7L-Yageo-datasheet-164759695.pdf?src-supplier=Future+Electronics; ComponentLink3Description: https://datasheet.octopart.com/RC0805FR-134K7L-Yageo-datasheet-164759695.pdf?src-supplier=Future+Electronics; ComponentLink4URL: https://datasheet.octopart.com/RC0805FR-134K7L-Yageo-datasheet-148775077.pdf?src-supplier=TME; ComponentLink4Description: https://datasheet.octopart.com/RC0805FR-134K7L-Yageo-datasheet-148775077.pdf?src-supplier=TME
R9 = RC0805JR-131ML: SMD Chip Resistor, 1 MOhm, ± 5%, 125 mW, 0805 [2012 Metric], Thick Film, General Purpose; Manufacturer: Yageo; Value: 1MR; Temperature Coefficient: 100ppm/°C; Power Rating: 125mW; Voltage Rating: 150V; Supplier: Digikey; Supplier Part Number: 13-RC0805JR-131MLCT-ND; Manufacturer Part Number: RC0805JR-131ML; RoHS: Yes; Category: Chip SMD Resistors; Stock: 25426; Pricing: 1=0.1, 10=0.023, 50=0.0144, 100=0.012, 500=0.00818, 1000=0.00706, 5000=0.00513, 10000=0.00454 (USD); Case/Package: 0805; Contact Plating: Tin,Matte; Case Code (Imperial): 0805; Case Code (Metric): 2012; Min Operating Temperature: -55°C; Max Operating Temperature: 155°C; Tolerance: 5%; Packaging: Tape and Reel; Termination: SMD/SMT; Series: RC; Length: 2mm; Width: 1.25mm; Height: 0.5mm; RoHS Compliant: Yes; ComponentLink1URL: http://www.mouser.com/ds/2/447/Yageo_08112016_RC0805-968729.pdf?src-supplier=Mouser; ComponentLink1Description: http://www.mouser.com/ds/2/447/Yageo_08112016_RC0805-968729.pdf?src-supplier=Mouser; ComponentLink2URL: http://www.yageo.com/documents/recent/PYu-RC_Group_51_RoHS_L_2.pdf?src-supplier=Avnet; ComponentLink2Description: http://www.yageo.com/documents/recent/PYu-RC_Group_51_RoHS_L_2.pdf?src-supplier=Avnet
S1 = PTS526SM15SMTR2LFS: Switch Tactile N.O. SPST Round Button Gull Wing 0.05A 12VDC 500000Cycles 1.57N SMD T/R; Manufacturer: ITT C&K; Contact Resistance: 100mR; Number of Positions: 2NUMBER; Supplier: Digikey; Supplier Part Number: CKN12220-1-ND; Manufacturer Part Number: PTS526SM15SMTR2LFS; RoHS: No; Category: Tactile Switches; Stock: 7522; Pricing: 1=0.14, 10=0.135, 25=0.1276, 100=0.1162, 250=0.1092, 500=0.09988, 1000=0.08363 (USD); ComponentLink1URL: https://dznh3ojzb2azq.cloudfront.net/products/Tactile/PTS526/documents/datasheet.pdf?src-supplier=Digikey; ComponentLink1Description: https://dznh3ojzb2azq.cloudfront.net/products/Tactile/PTS526/documents/datasheet.pdf?src-supplier=Digikey; ComponentLink2URL: https://datasheet.octopart.com/PTS526SM15SMTR2LFS-C%26K-Components-datasheet-138817219.pdf?src-supplier=Future+Electronics; ComponentLink2Description: https://datasheet.octopart.com/PTS526SM15SMTR2LFS-C%26K-Components-datasheet-138817219.pdf?src-supplier=Future+Electronics; ComponentLink3URL: https://datasheet.octopart.com/PTS526SM15SMTR2LFS-C%26K-Components-datasheet-166147767.pdf?src-supplier=TME; ComponentLink3Description: https://datasheet.octopart.com/PTS526SM15SMTR2LFS-C%26K-Components-datasheet-166147767.pdf?src-supplier=TME
U1 = STM32F103C8T6: ARM Cortex-M3 STM32 F1 Microcontroller 32-Bit 72MHz 64kB FLASH LQFP48 STM32F103C8T6; Manufacturer: STMicroelectronics; RAM Size: 20KB; Interface: I2C,SPI,USB,CAN,USART; Number of I/Os: 37; Number of Timers/Counters: 3; Max Supply Voltage: 3.6V; Number of ADC Channels: 10; Min Supply Voltage: 2V; Data Bus Width: 32b; Nominal Supply Current: 1.7uA; Number of A/D Converters: 2; Supplier: Mouser; Supplier Part Number: 511-STM32F103C8T6; Manufacturer Part Number: STM32F103C8T6; RoHS: Yes; Category: Microcontrollers; Stock: 24929; Pricing: 1=6.11, 10=5.53, 50=5.27, 100=4.58, 1000=3.47, 10000=3.33 (USD); Case/Package: LQFP; Pins: 48; Weight: 0.006349oz; Min Operating Temperature: -40°C; Max Operating Temperature: 85°C; Packaging: Tray; Package Quantity: 1500; Memory Format: FLASH; Clock Frequency: 72MHz; Memory Size: 64KB; Core Architecture: ARM; Series: STM32F103C8; Number of Channels: 10; Length: 7mm; Width: 7mm; Height: 1.4mm; Lead Free: Lead Free; RoHS Compliant: Yes; ComponentLink1URL: https://datasheet.ciiva.com/15122/getdatasheetpartid-69880-15122076.pdf?src-supplier=Verical; ComponentLink1Description: https://datasheet.ciiva.com/15122/getdatasheetpartid-69880-15122076.pdf?src-supplier=Verical; ComponentLink2URL: https://datasheet.ciiva.com/8054/1730126-8054942.pdf?src-supplier=Element14; ComponentLink2Description: https://datasheet.ciiva.com/8054/1730126-8054942.pdf?src-supplier=Element14; ComponentLink3URL: https://datasheet.ciiva.com/14100/pustm-arm-microcont-stm32f103-en-14100508.pdf?src-supplier=Distrelec; ComponentLink3Description: https://datasheet.ciiva.com/14100/pustm-arm-microcont-stm32f103-en-14100508.pdf?src-supplier=Distrelec; ComponentLink4URL: https://datasheet.ciiva.com/16210/cd00161566-16210248.pdf?src-supplier=Future+Electronics; ComponentLink4Description: https://datasheet.ciiva.com/16210/cd00161566-16210248.pdf?src-supplier=Future+Electronics; ComponentLink5URL: https://datasheet.ciiva.com/48687/001075658-da-01-en-mcu-64kb-mem-stm32f103c8t6-lqfp-48-stm-48687589.pdf?src-supplier=Conrad; ComponentLink5Description: https://datasheet.ciiva.com/48687/001075658-da-01-en-mcu-64kb-mem-stm32f103c8t6-lqfp-48-stm-48687589.pdf?src-supplier=Conrad
U2 = RT9193-33GB: LDO Regulator Pos 3.3V 0.3A 5-Pin SOT-23; Manufacturer: Richtek; Supplier: Digikey; Supplier Part Number: 1028-1014-1-ND; Manufacturer Part Number: RT9193-33GB; RoHS: Yes; Category: Voltage Regulators - Linear; Stock: 26926; Pricing: 1=0.53, 10=0.454, 25=0.424, 100=0.3394, 250=0.31512, 500=0.26664, 1000=0.20604 (USD); ComponentLink1URL: https://datasheet.ciiva.com/2046/3d3futf-83fb3frfm5mtkzlte2lnbkzg3d3d3f3d-2046896.pdf?src-supplier=Digikey; ComponentLink1Description: https://datasheet.ciiva.com/2046/3d3futf-83fb3frfm5mtkzlte2lnbkzg3d3d3f3d-2046896.pdf?src-supplier=Digikey; ComponentLink2URL: https://datasheet.ciiva.com/28652/1782157-28652989.pdf?src-supplier=Element14; ComponentLink2Description: https://datasheet.ciiva.com/28652/1782157-28652989.pdf?src-supplier=Element14
Y1 = FC4SDCBMF8.0-T1: Crystal 8MHz ±30ppm (Tol) ±50ppm (Stability) 20pF FUND 80Ohm 2-Pin HC-49/SDLF SMD T/R; Manufacturer: Fox Electronics; ESR (Equivalent Series Resistance): 80R; Supplier: Arrow Electronics; Supplier Part Number: FC4SDCBMF8.0-T1; Manufacturer Part Number: FC4SDCBMF8.0-T1; RoHS: Yes; Stock: 12000; Pricing: 1000=0.1586, 3000=0.157, 5000=0.1562 (USD); Mounting Technology: Surface Mount; Min Operating Temperature: -20°C; Max Operating Temperature: 70°C; Series: HC49SDLF; Packaging: Cut Tape; Frequency: 8MHz; Frequency Stability: 50ppm; Frequency Tolerance: 30ppm; Load Capacitance: 20pF; ComponentLink1URL: http://www.foxonline.com/pdfs/C4SD.pdf?src-supplier=Digikey; ComponentLink1Description: http://www.foxonline.com/pdfs/C4SD.pdf?src-supplier=Digikey; ComponentLink2URL: http://datasheet.octopart.com/FC4SDCBMF8.0-T1-Fox-Electronics-datasheet-136840669.pdf?src-supplier=Rs; ComponentLink2Description: http://datasheet.octopart.com/FC4SDCBMF8.0-T1-Fox-Electronics-datasheet-136840669.pdf?src-supplier=Rs
Y2 = CM8V-T1A-32.768KHZ-7PF-20PPM-TA-QC: Crystal 32.7680KHZ 7PF SMD; Manufacturer: Micro Crystal; Supplier: Arrow Electronics; Supplier Part Number: CM8V-T1A-32.768KHZ-7PF-20PPM-TA-QC; Manufacturer Part Number: CM8V-T1A-32.768KHZ-7PF-20PPM-TA-QC; RoHS: No; Stock: 87569; Pricing: 1=0.5881, 10=0.4944, 50=0.4378, 100=0.3862, 500=0.3784, 1000=0.2933, 3000=0.2822, 5000=0.27, 10000=0.2581 (USD)